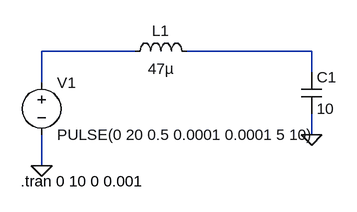
[diagram p0: schematic Draft9.asc]
Draft9.asc, the LTspice schematic file:
Version 4.1
SHEET 1 880 680
WIRE 144 64 0 64
WIRE 416 64 224 64
WIRE 416 96 416 64
WIRE 0 112 0 64
WIRE 416 192 416 160
WIRE 0 240 0 192
FLAG 416 192 0
FLAG 0 240 0
SYMBOL cap 400 96 R0
SYMATTR InstName C1
SYMATTR Value 10
SYMATTR SpiceLine V=27
SYMBOL ind 128 80 R270
WINDOW 0 32 56 VTop 2
WINDOW 3 5 56 VBottom 2
SYMATTR InstName L1
SYMATTR Value 47µ
SYMATTR SpiceLine Rser=100m
SYMBOL voltage 0 96 R0
WINDOW 123 0 0 Left 0
WINDOW 39 24 124 Left 2
SYMATTR InstName V1
SYMATTR Value PULSE(0 20 0.5 0.0001 0.0001 5 10)
TEXT -32 264 Left 2 !.tran 0 10 0 0.001

The netlist it stands for:
* Draft9.asc
C1 N002 0 10 V=27
L1 N001 N002 47µ Rser=100m
V1 N001 0 PULSE(0 20 0.5 0.0001 0.0001 5 10)
.tran 0 10 0 0.001
.backanno
.end